# EasyEDA Pro project ProPrj_AD7606_audio_analyze.epro

# Schematic Schematic1
Board Name: Board1; Create Date: 2025-11-26; Page Name: P1; Project Name: 数电大作业; Schematic Name: Schematic1; Update Date: 2025-11-29; Company: 嘉立创EDA; Page Size: A4; Version: V1.0
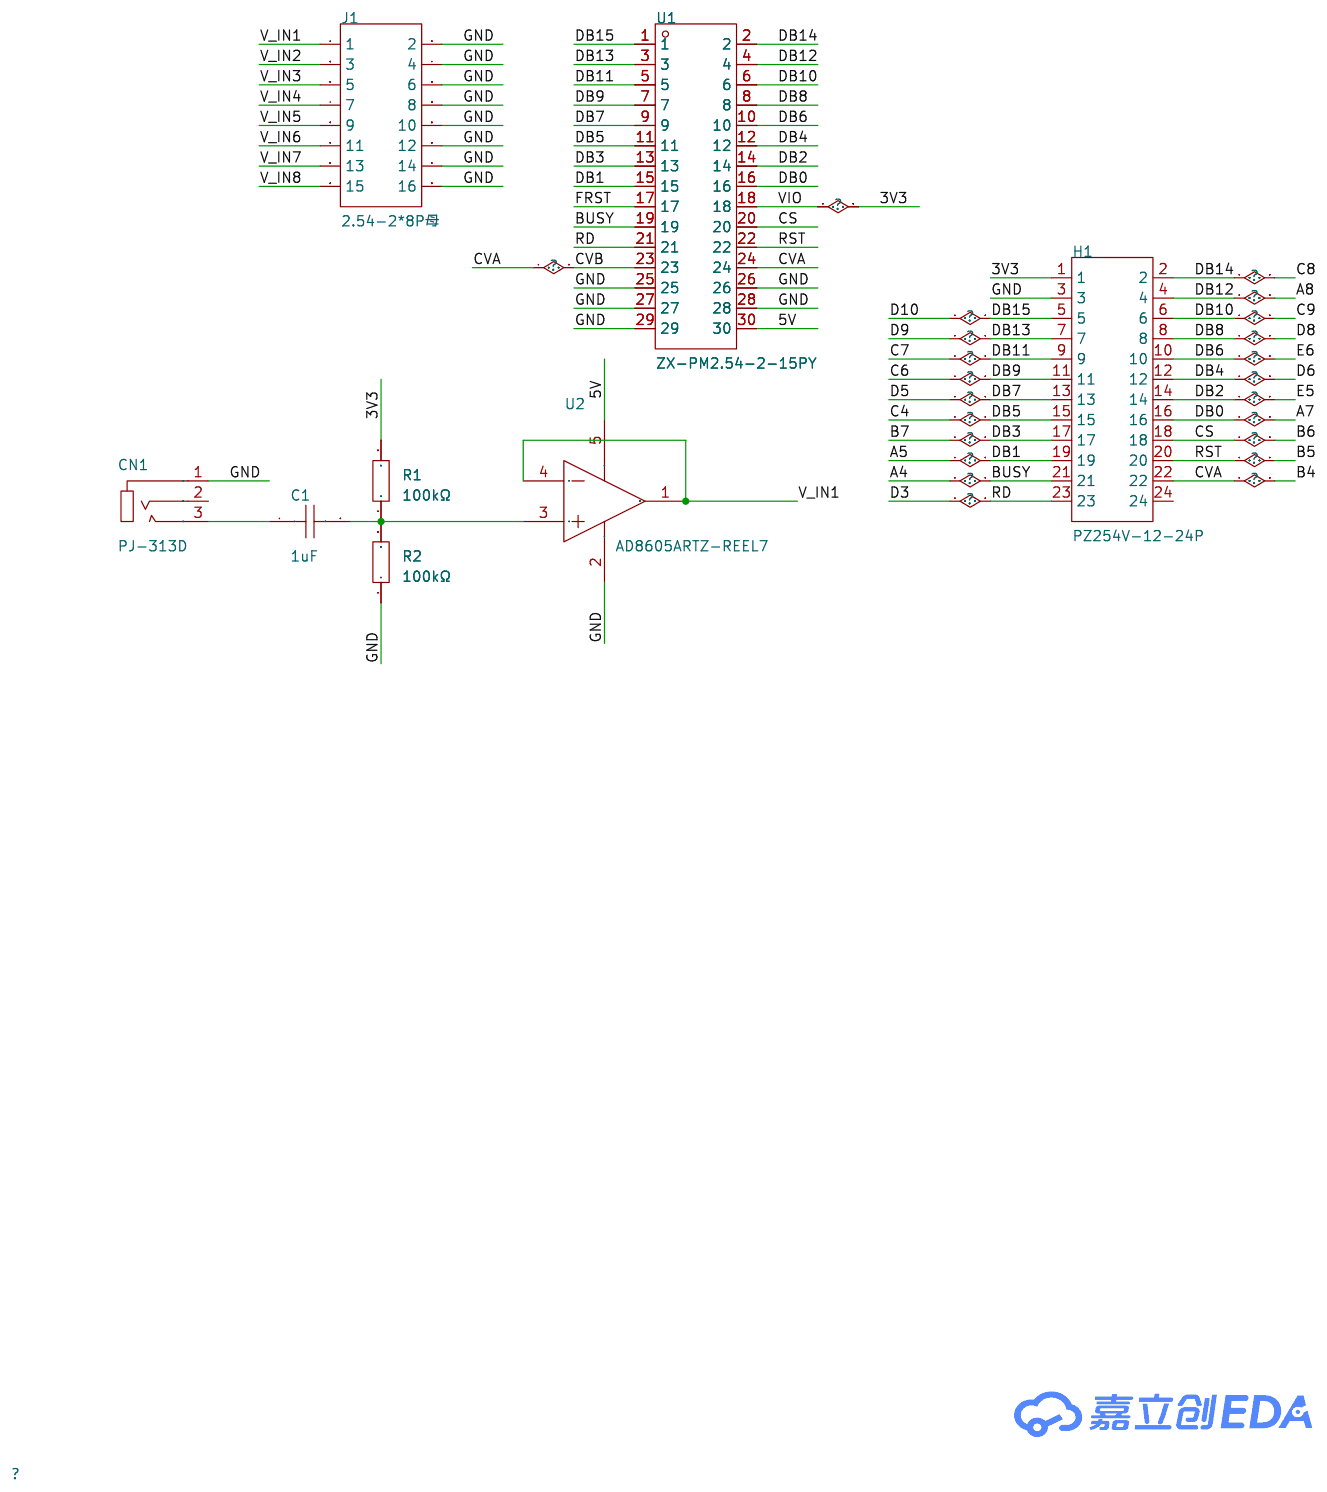
[diagram p0: schematic sheet]

## Parts
C1  1uF  [C0603]
CN1  PJ-313D  [AUDIO-SMD_PJ-313D-2]
H1  PZ254V-12-24P  [HDR-TH_24P-P2.54-V-M-R2-C12-S2.54]
J1  2.54-2*8P母  [HDR-TH_16P-P2.54-V-F-R2-C8-S2.54]
R1  100kΩ  [R1206]
R2  100kΩ  [R1206]
U1  ZX-PM2.54-2-15PY  [HDR-TH_30P-P2.54-V-F-R2-C15-S2.54]
U2  AD8605ARTZ-REEL7  [SOT-23-5_L3.0-W1.7-P0.95-LS2.8-BR]

## Library data of the parts
C1 = CGA0603X5R105K500JT: 容值:1uF;精度:±10%;额定电压:50V;温度系数:X5R;; LCSC Part Name: 1uF ±10% 50V; Supplier Part: C6119852; Manufacturer: HRE(芯声); Supplier Footprint: 0603; JLCPCB Part Class: 扩展库; Supplier: LCSC; Tolerance: ±10%; Voltage Rating: 50V; Temperature Coefficient: X5R
CN1 = PJ-313D_C668608: 连接器类型:3.5mm耳机座;额定电流:500mA;额定电压:30V;触头材质:-;触头镀层:银;工作温度:-30℃~+70℃;; LCSC Part Name: 3.5mm耳机座; Supplier Part: C668608; Manufacturer: SHOU HAN(首韩); Supplier Footprint: SMD; JLCPCB Part Class: 扩展库; Datasheet: https://item.szlcsc.com/datasheet/PJ-313D/698551.html; Supplier: LCSC; Connector Type: 3.5mm耳机座; Current Rating: 500mA; Voltage Rating (Max): 30V; Contact Plating: 银; Operating Temperature: -30℃~+70℃
H1 = PZ254V-12-24P: 插针结构:2x12P;间距:2.54mm;行距:2.54mm;圆针/方针:方针;安装方式:直插;排数:双排;总PIN位数:24P;额定电流:-;额定电压:-;配合针长度:6mm;塑高:2.5mm;端接针长度:3mm;触头材质:黄铜;触头镀层:-;工作温度:-40℃~+105℃;颜色:黑色;; LCSC Part Name: 2x12P 间距:2.54mm 方针 直插; Supplier Part: C492429; Manufacturer: XFCN(兴飞); Supplier Footprint: 插件,P=2.54mm; JLCPCB Part Class: 扩展库; Datasheet: https://item.szlcsc.com/datasheet/PZ254V-12-24P/502985.html; Supplier: LCSC; Pin Structure: 2x12P; Pitch: 2.54mm; Row Spacing: 2.54mm; Circluar Pins/Square Pins: 方针; Mounting Type: 直插; Number of Rows: 双排; Number of Pins: 24P; Length of Mating Pin: 6mm; Insulation Height: 2.5mm; Length of End Connection Pin: 3mm; Contact Material: 黄铜; Operating Temperature: -40℃~+105℃; Color: 黑色
J1 = 2.54-2*8P母: 插孔结构:2x8P;间距:2.54mm;行距:2.54mm;圆孔/方孔:方孔;安装方式:直插;排数:双排;总孔位数:16P;插孔方向:顶部;塑高:-;触头材质:黄铜;触头镀层:-;; LCSC Part Name: 2x8P 间距:2.54mm 直插; Supplier Part: C30734; Manufacturer: BOOMELE(博穆精密); Supplier Footprint: 插件,P=2.54mm; JLCPCB Part Class: 扩展库; Datasheet: https://item.szlcsc.com/datasheet/2.54-2*8P%25E6%25AF%258D/31491.html; Supplier: LCSC; Holes Structure: 2x8P; Pitch: 2.54mm; Row Spacing: 2.54mm; Circular Hole / Square Hole: 方孔; Mounting Type: 直插; Number of Rows: 双排; Number of Positions: 16P; Holes Direction: 顶部; Contact Material: 黄铜
R1 R2 = 1206W4F1003T5E: 电阻类型:厚膜电阻;阻值:100kΩ;精度:±1%;功率:250mW;工作电压:200V;温度系数:±100ppm/℃;; LCSC Part Name: 100kΩ ±1% 250mW 厚膜电阻; Supplier Part: C17900; Manufacturer: UNI-ROYAL(厚声); Supplier Footprint: 1206; JLCPCB Part Class: 基础库; Datasheet: https://item.szlcsc.com/datasheet/1206W4F1003T5E/18588.html; Supplier: LCSC; Type: 厚膜电阻; Tolerance: ±1%; Power(Watts): 250mW; Voltage-Supply(Max): 200V; Temperature Coefficient: ±100ppm/℃; Operating Temperature: -55℃~+155℃
U1 = ZX-PM2.54-2-15PY: 插孔结构:2x15P;间距:2.54mm;行距:2.54mm;圆孔/方孔:方孔;安装方式:直插;排数:双排;总孔位数:30P;额定电流:3A;额定电压:-;插孔方向:顶部;塑高:8.5mm;触头材质:黄铜;触头镀层:金;工作温度:-40℃~+105℃;; LCSC Part Name: 2x15P 间距:2.54mm 直插; Supplier Part: C7499350; Manufacturer: Megastar(兆星); Supplier Footprint: 插件,P=2.54mm; JLCPCB Part Class: 扩展库; Datasheet: https://item.szlcsc.com/datasheet/ZX-PM2.54-2-15PY/8574011.html; Supplier: LCSC; Holes Structure: 2x15P; Pitch: 2.54mm; Row Spacing: 2.54mm; Circular Hole / Square Hole: 方孔; Mounting Type: 直插; Number of Rows: 双排; Number of Positions: 30P; Current Rating: 3A; Holes Direction: 顶部; Insulation Height: 8.5mm; Contact Material: 黄铜; Contact Plating: 金; Operating Temperature: -40℃~+105℃; PIN Length: 3.2mm
U2 = AD8605ARTZ-REEL7: 放大器数:单路;增益带宽积(GBP):10MHz;输入偏置电流(Ib):0.2pA;输入失调电压(Vos):65uV;压摆率(SR):5V/us;轨到轨:轨到轨输入,轨到轨输出;; LCSC Part Name: 精密、低噪声、轨到轨输入输出、CMOS运算放大器; Supplier Part: C9641; Manufacturer: ADI(亚德诺); Supplier Footprint: SOT-23-5; JLCPCB Part Class: 扩展库; Datasheet: https://item.szlcsc.com/datasheet/AD8605ARTZ-REEL7/10171.html; Supplier: LCSC; Number of Channels: 单路; Gain Bandwidth Product: 10MHz; Ib - Input Bias Current: 0.2pA; Vos - Input Offset Voltage: 65uV; Common Mode Rejection Ratio(CMRR): 100dB; Slew Rate: 5V/us; Output Current: 80mA; Rail to Rail: 轨到轨输入,轨到轨输出; Input Offset Voltage Drift(Vos TC): 4.5uV/℃; Quiescent Current(Iq): 1.2mA; Operating Temperature: -40℃~+125℃; Single Supply: 2.7V~5.5V; Maximum Power Supply Range (Vdd-Vss): 5.5V; Noise density(eN): 8nV/√Hz@1kHz; Input Offset Current(Ios): 0.5pA

## Nets
3V3: H1.1 R1.2 U1.18
5V: U1.30 U2.5(+V)
GND: CN1.1 H1.3 J1.2 J1.4 J1.6 J1.8 J1.10 J1.12 J1.14 J1.16 R2.1 U1.25 U1.26 U1.27 U1.28 U1.29 U2.2(-V)
A4: H1.21 U1.19
A5: H1.19 U1.15
A7: H1.16 U1.16
A8: H1.4 U1.4
B4: H1.22 U1.23 U1.24
B5: H1.20 U1.22
B6: H1.18 U1.20
B7: H1.17 U1.13
C4: H1.15 U1.11
C6: H1.11 U1.7
C7: H1.9 U1.5
C8: H1.2 U1.2
C9: H1.6 U1.6
D3: H1.23 U1.21
D5: H1.13 U1.9
D6: H1.12 U1.12
D8: H1.8 U1.8
D9: H1.7 U1.3
D10: H1.5 U1.1
DB2: H1.14 U1.14
DB6: H1.10 U1.10
FRST: U1.17
V_IN1: J1.1 U2.1(OUT) U2.4(-IN)
V_IN2: J1.3
V_IN3: J1.5
V_IN4: J1.7
V_IN5: J1.9
V_IN6: J1.11
V_IN7: J1.13
V_IN8: J1.15
Net-(C1-1): C1.1 CN1.3
Net-(C1-2): C1.2 R1.1 R2.2 U2.3(+IN)

Not connected (* = marked no-connect by the designer): CN1 2; H1 24

# Board PCB1
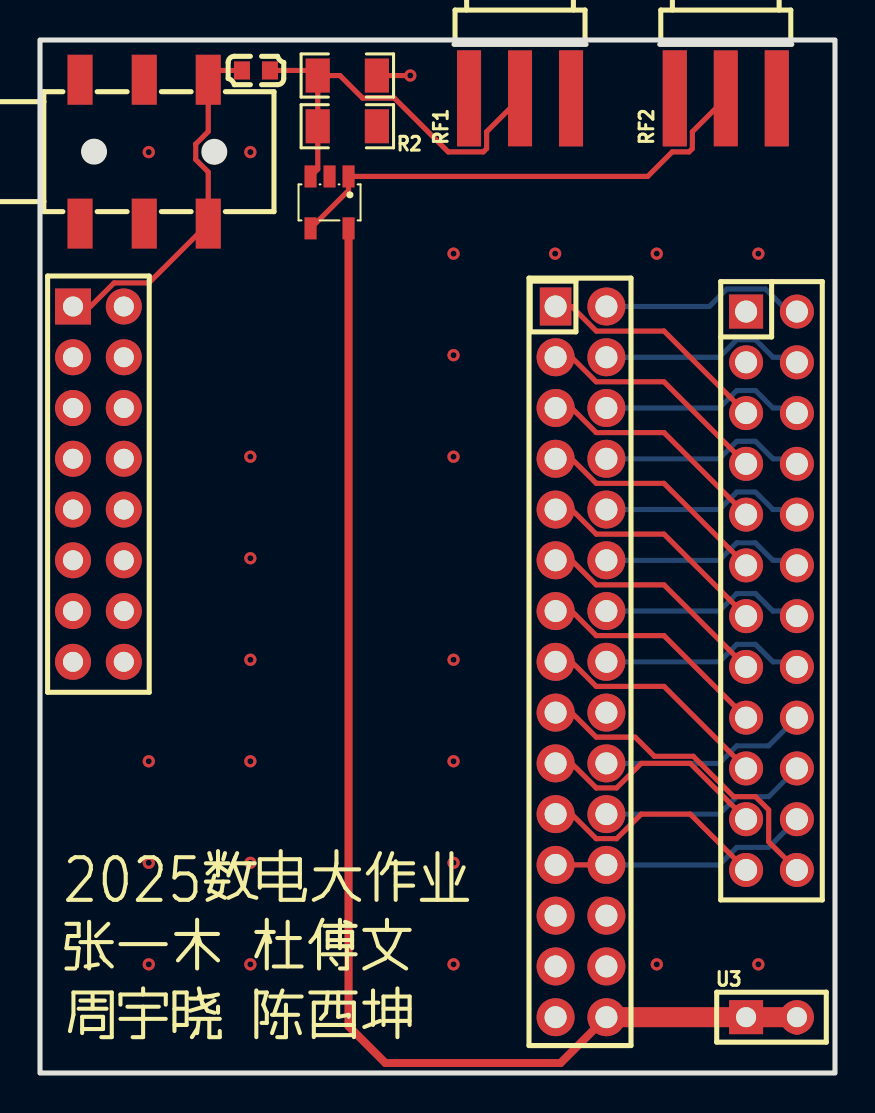
[diagram p1: board, top side]
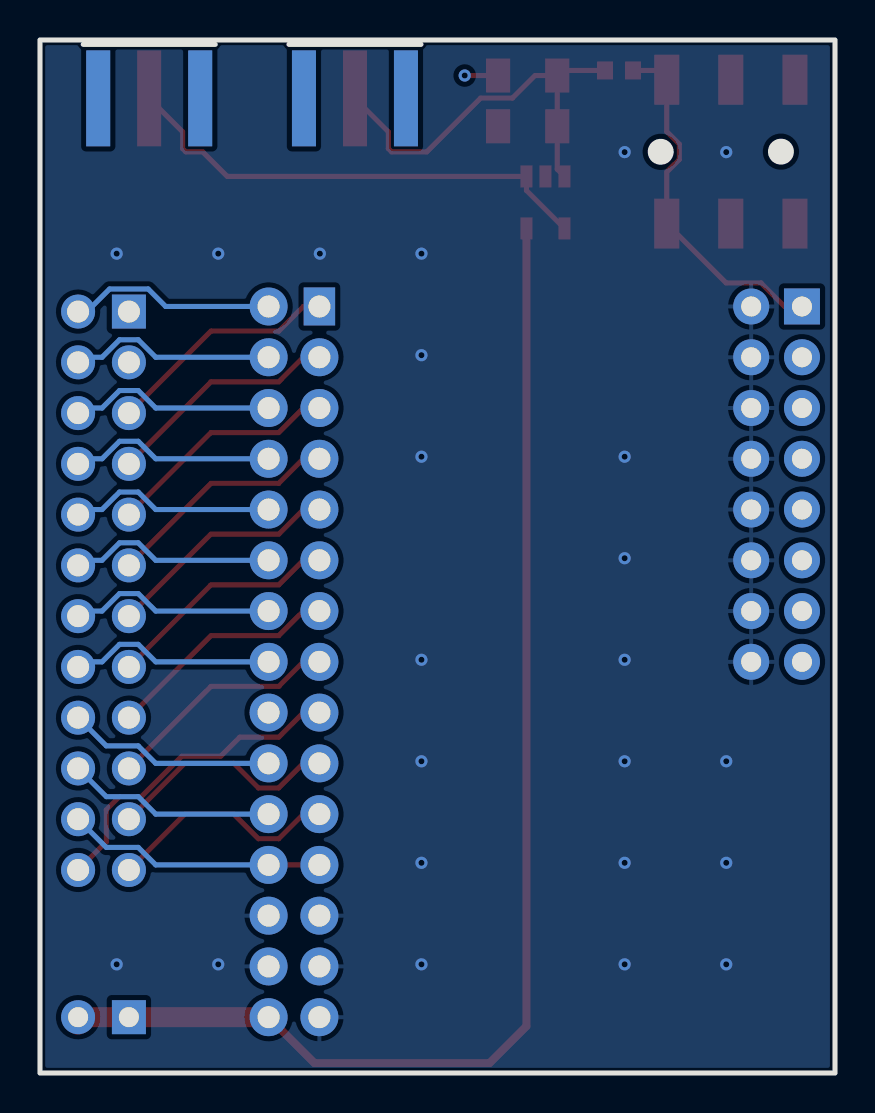
[diagram p2: board, bottom side, seen from below]

Outline 39.75 x 51.69 mm; copper layers: Top Layer, Inner1, Inner2, Bottom Layer. Coordinates in mm from the lower left corner of the outline.
Outline path: rectangle 0,51.69 39.75,0
Stack: Top Layer 0.035mm 外层铜厚1oz / Dielectric1 0.2104mm 7628 RC49% 8.6mil / Inner1 0.0152mm 内层铜厚 / Dielectric2 1.065mm 1.1mm H/HOZ Copper / Inner2 0.0152mm 内层铜厚 / Dielectric3 0.2104mm 7628 RC49% 8.6mil / Bottom Layer 0.035mm 外层铜厚1oz

## Design rules (mm)
template: JLCPCB Capability(Two Layers Board)
spacing copperThickness1oz (default): track to track 0.102, other pairs 0.152 to 0.3
spacing copperThickness2oz: track to track 0.203, other pairs 0.152 to 0.3
track width copperThickness1oz (default): min 0.127, default 0.254, max 2.54
track width copperThickness2oz: min 0.203, default 0.254, max 2.54
differential pair differentialPair (default): width min 0.127, default 0.254, max 2.54; gap min 0.152, default 0.152
via viaSize (default): diameter min 0.5, default 0.61, max 10; hole min 0.3, default 0.305, max 6.3

## Placement (name value [footprint] x y rotation side)
C1  1uF  [C0603]  10.8 50.16 0 top
CN1  PJ-313D  [AUDIO-SMD_PJ-313D-2]  5.21 46.1 90 top
H1  PZ254V-12-24P  [HDR-TH_24P-P2.54-V-M-R2-C12-S2.54]  36.58 24.13 270 top
J1  2.54-2*8P母  [HDR-TH_16P-P2.54-V-F-R2-C8-S2.54]  2.92 29.46 270 top
R1  100kΩ  [R1206]  15.37 49.91 0 top
R2  100kΩ  [R1206]  15.37 47.37 180 top
RF1  -  [SMA-SMD_BWSMA-KE-P001]  24 48.77 90 top
RF2  -  [SMA-SMD_BWSMA-KE-P001]  34.29 48.77 90 top
U1  ZX-PM2.54-2-15PY  [HDR-TH_30P-P2.54-V-F-R2-C15-S2.54]  27.05 20.57 270 top
U2  AD8605ARTZ-REEL7  [SOT-23-5_L3.0-W1.7-P0.95-LS2.8-BR]  14.48 43.56 90 top
U3  ZX-PM2.54-1-2PY  [HDR-TH_2P-P2.54-V-F]  36.58 2.79 0 top

## Footprints (pads in the part's own frame, mm; a bottom-side part is the same pattern mirrored in y, then rotated)
AUDIO-SMD_PJ-313D-2
  rect 2.5x1.25 smd: 1(-3.6,3.205) 1(3.6,3.205) 2(-3.6,-0.005) 2(3.6,-0.005) 3(-3.6,-3.205) 3(3.6,-3.205)
C0603
  rect 0.8x0.9 smd: 1(-0.7,0) 2(0.7,0)
HDR-TH_2P-P2.54-V-F
  rect 1.7x1.7 hole 1: 1(-1.27,0)
  round 1.7 hole 1: 2(1.27,0)
HDR-TH_16P-P2.54-V-F-R2-C8-S2.54
  rect 1.8x1.8 hole 1: 1(-8.89,-1.27)
  round 1.8 hole 1: 2(-8.89,1.27) 3(-6.35,-1.27) 4(-6.35,1.27) 5(-3.81,-1.27) 6(-3.81,1.27) 7(-1.27,-1.27) 8(-1.27,1.27) 9(1.27,-1.27) 10(1.27,1.27) 11(3.81,-1.27) 12(3.81,1.27) 13(6.35,-1.27) 14(6.35,1.27) 15(8.89,-1.27) 16(8.89,1.27)
HDR-TH_24P-P2.54-V-M-R2-C12-S2.54
  rect 1.7x1.7 hole 1.1: 1(-13.97,-1.27)
  round 1.7 hole 1.1: 2(-13.97,1.27) 3(-11.43,-1.27) 4(-11.43,1.27) 5(-8.89,-1.27) 6(-8.89,1.27) 7(-6.35,-1.27) 8(-6.35,1.27) 9(-3.81,-1.27) 10(-3.81,1.27) 11(-1.27,-1.27) 12(-1.27,1.27) 13(1.27,-1.27) 14(1.27,1.27) 15(3.81,-1.27) 16(3.81,1.27) 17(6.35,-1.27) 18(6.35,1.27) 19(8.89,-1.27) 20(8.89,1.27) 21(11.43,-1.27) 22(11.43,1.27) 23(13.97,-1.27) 24(13.97,1.27)
HDR-TH_30P-P2.54-V-F-R2-C15-S2.54
  rect 1.9x1.575 hole 1.1: 1(-17.78,-1.27)
  round 1.9 hole 1.1: 2(-17.78,1.27) 3(-15.24,-1.27) 4(-15.24,1.27) 5(-12.7,-1.27) 6(-12.7,1.27) 7(-10.16,-1.27) 8(-10.16,1.27) 9(-7.62,-1.27) 10(-7.62,1.27) 11(-5.08,-1.27) 12(-5.08,1.27) 13(-2.54,-1.27) 14(-2.54,1.27) 15(0,-1.27) 16(0,1.27) 17(2.54,-1.27) 18(2.54,1.27) 19(5.08,-1.27) 20(5.08,1.27) 21(7.62,-1.27) 22(7.62,1.27) 23(10.16,-1.27) 24(10.16,1.27) 25(12.7,-1.27) 26(12.7,1.27) 27(15.24,-1.27) 28(15.24,1.27) 29(17.78,-1.27) 30(17.78,1.27)
R1206
  rect 1.208x1.701 smd: 1(-1.479,0) 2(1.479,0)
SMA-SMD_BWSMA-KE-P001
  rect 4.8x1.2 smd: 1(0,-2.55) 2(0,2.55) 5(0,0)
  rect 4.8x1.2 smd far side: 3(0,2.55) 4(0,-2.55)
SOT-23-5_L3.0-W1.7-P0.95-LS2.8-BR
  rect 1.1x0.6 smd: 1(1.3,-0.95) 2(1.3,0) 3(1.3,0.95) 4(-1.3,0.95) 5(-1.3,-0.95)

## Nets
3V3: H1.1 R1.2 U1.18
5V: U1.30 U2.5 U3.1 U3.2
GND: CN1.1 H1.3 J1.2 J1.4 J1.6 J1.8 J1.10 J1.12 J1.14 J1.16 R2.1 RF1.1 RF1.2 RF2.1 RF2.2 U1.25 U1.26 U1.27 U1.28 U1.29 U2.2
BUSY: H1.21 U1.19
CS: H1.18 U1.20
CVA: H1.22 U1.23 U1.24
DB0: H1.16 U1.16
DB1: H1.19 U1.15
DB2: H1.14 U1.14
DB3: H1.17 U1.13
DB4: H1.12 U1.12
DB5: H1.15 U1.11
DB6: H1.10 U1.10
DB7: H1.13 U1.9
DB8: H1.8 U1.8
DB9: H1.11 U1.7
DB10: H1.6 U1.6
DB11: H1.9 U1.5
DB12: H1.4 U1.4
DB13: H1.7 U1.3
DB14: H1.2 U1.2
DB15: H1.5 U1.1
FRST: H1.24 U1.17
RD: H1.23 U1.21
RST: H1.20 U1.22
V_IN1: RF2.5 U2.1 U2.4
V_IN2: J1.3
V_IN3: J1.5
V_IN4: J1.7
V_IN5: J1.9
V_IN6: J1.11
V_IN7: J1.13
V_IN8: J1.15
$1N1829: C1.1 CN1.3 J1.1
$1N2017: C1.2 R1.1 R2.2 RF1.5 U2.3

Pads without a net: CN1 2; RF1 3 4; RF2 3 4

## Via types
v1: diameter 0.61, hole 0.305, Top Layer to Bottom Layer, 24 vias

## Routing (per net, layer and track width the routed paths; a pad name or vN(x,y) marks a point on that pad's centre or on a via; arc(x,y) is an arc through that point)
3V3: length 1.7
  Top Layer w0.254: v1(18.52,49.91) R1.2
5V: length 64.2
  Top Layer w0.4: U2.5 15.43,2.34 17.27,0.5 26.03,0.5 U1.30
  Top Layer w1: 37.85,2.41 37.47,2.79 U1.30
GND:
  vias: v1(5.44,46.08) v1(5.44,15.6) v1(5.44,10.52) v1(5.44,5.44) v1(10.52,46.08) v1(10.52,30.84) v1(10.52,25.76) v1(10.52,20.68) v1(10.52,15.6) v1(10.52,10.52) v1(10.52,5.44) v1(20.68,41) v1(20.68,35.92) v1(20.68,30.84) v1(20.68,20.68) v1(20.68,15.6) v1(20.68,10.52) v1(20.68,5.44) v1(25.76,41) v1(30.84,41) v1(30.84,5.44) v1(35.92,41) v1(35.92,5.44)
BUSY: length 11.7
  Top Layer w0.254: 35.31,12.7 32.51,15.49 30.06,15.49 28.83,14.27 27.81,14.27 26.58,15.49 U1.19
CS: length 10.5
  Bottom Layer w0.254: U1.20 33.96,15.49 34.84,16.37 36.44,16.37 H1.18
CVA: length 13
  Top Layer w0.254: U1.23 U1.24
  Bottom Layer w0.254: U1.24 33.96,10.41 34.84,11.29 36.44,11.29 H1.22
DB0: length 10.4
  Bottom Layer w0.254: H1.16 37.59,20.57 36.65,20.57 35.77,21.45 34.84,21.45 33.96,20.57 U1.16
DB1: length 11.7
  Top Layer w0.254: U1.15 26.58,20.57 27.81,19.35 31.2,19.35 35.31,15.24
DB2: length 10.4
  Bottom Layer w0.254: U1.14 33.96,23.11 34.84,23.99 35.77,23.99 36.65,23.11 37.59,23.11 H1.14
DB3: length 11.7
  Top Layer w0.254: 35.31,17.78 31.2,21.89 27.81,21.89 26.58,23.11 U1.13
DB4: length 10.4
  Bottom Layer w0.254: H1.12 37.59,25.65 36.65,25.65 35.77,26.53 34.84,26.53 33.96,25.65 U1.12
DB5: length 11.7
  Top Layer w0.254: U1.11 26.58,25.65 27.81,24.43 31.2,24.43 35.31,20.32
DB6: length 10.4
  Bottom Layer w0.254: H1.10 37.59,28.19 36.65,28.19 35.77,29.07 34.84,29.07 33.96,28.19 U1.10
DB7: length 11.7
  Top Layer w0.254: U1.9 26.58,28.19 27.81,26.97 31.2,26.97 35.31,22.86
DB8: length 10.4
  Bottom Layer w0.254: U1.8 33.96,30.73 34.84,31.61 35.77,31.61 36.65,30.73 37.59,30.73 H1.8
DB9: length 11.7
  Top Layer w0.254: U1.7 26.58,30.73 27.81,29.51 31.2,29.51 35.31,25.4
DB10: length 10.4
  Bottom Layer w0.254: H1.6 37.59,33.27 36.65,33.27 35.77,34.15 34.84,34.15 33.96,33.27 U1.6
DB11: length 11.7
  Top Layer w0.254: U1.5 26.58,33.27 27.81,32.05 31.2,32.05 35.31,27.94
DB12: length 10.4
  Bottom Layer w0.254: H1.4 37.59,35.81 36.65,35.81 35.77,36.69 34.84,36.69 33.96,35.81 U1.4
DB13: length 11.7
  Top Layer w0.254: 35.31,30.48 31.2,34.59 27.81,34.59 26.58,35.81 U1.3
DB14: length 10.4
  Bottom Layer w0.254: U1.2 33.47,38.35 34.34,39.23 36.27,39.23 37.15,38.35 37.59,38.35 H1.2
DB15: length 11.7
  Top Layer w0.254: 35.31,33.02 31.2,37.13 27.81,37.13 26.58,38.35 U1.1
FRST: length 16.3
  Top Layer w0.254: U1.17 26.58,18.03 27.81,16.81 29.76,16.81 30.72,15.85 32.66,15.85 34.68,13.83 35.77,13.83 36.44,13.17 36.44,11.57 H1.24
RD: length 11.7
  Top Layer w0.254: U1.21 26.58,12.95 27.81,11.73 28.83,11.73 30.06,12.95 32.51,12.95 35.31,10.16
RST: length 10.5
  Bottom Layer w0.254: U1.22 33.96,12.95 34.84,13.83 36.44,13.83 H1.20
V_IN1: length 24.4
  Top Layer w0.254: RF2.5 32.62,47.1 32.62,46.25 32.46,46.09 31.61,46.09 30.38,44.86 15.43,44.86 15.43,44.16 13.53,42.26
$1N1829: length 18.1
  Top Layer w0.254: J1.1 2.52,38.35 3.7,39.53 5.44,39.53 CN1.3 8.41,45.08 7.79,45.71 7.79,46.48 8.41,47.11 CN1.3 8.87,50.16 C1.1
$1N2017: length 21
  Top Layer w0.254: RF1.5 22.33,47.1 22.33,46.25 22.17,46.09 20.41,46.09 17.72,48.78 16.13,48.78 15,49.91 R1.1 ; R1.1 13.64,50.16 C1.2 ; R1.1 R2.2 13.89,45.22 13.53,44.86

## Copper pours and planes (outline as drawn; the poured copper is in the pictures)
3V3 on Inner2: -3.56,56.26 46.61,56.26 46.61,-10.41 -3.56,-10.41
GND on Top Layer: -1.4,57.28 41.15,57.28 41.15,3.3 -1.4,3.3
GND on Bottom Layer: -4.95,54.48 48.77,54.48 48.77,-3.94 -4.95,-3.94
GND on Inner1: -2.29,53.47 42.67,53.47 42.67,-7.11 -2.29,-7.11

## Text on the board
Top Silkscreen Layer: 2025数电大作业 / 张一木 杜傅文 / 周宇晓 陈酉坤
